# Altium schematic sheet ZLS-018 Rev 5.SchDoc
size OrCAD C
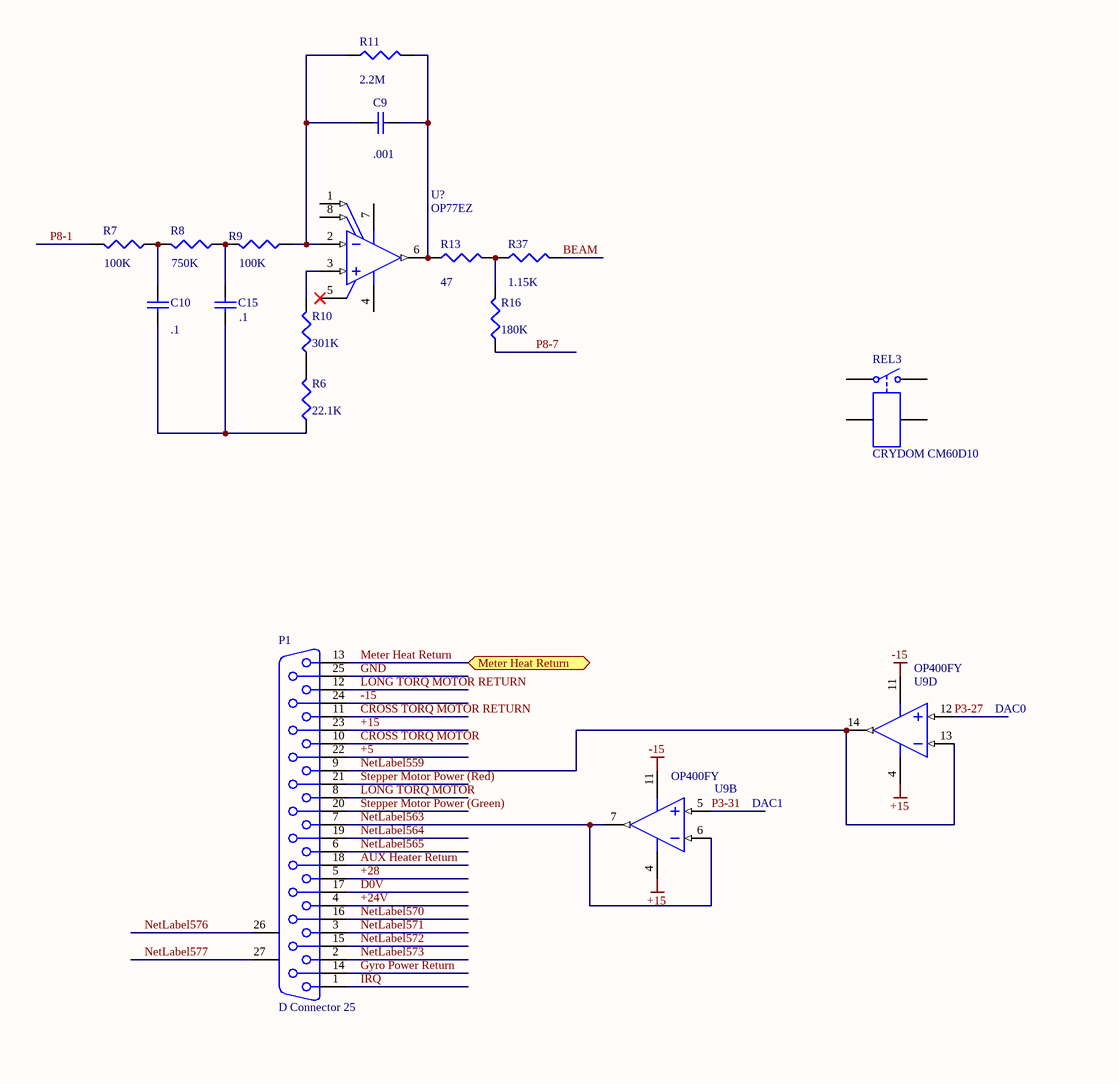
[diagram p0: ZLS-018 Rev 5.SchDoc, top left]
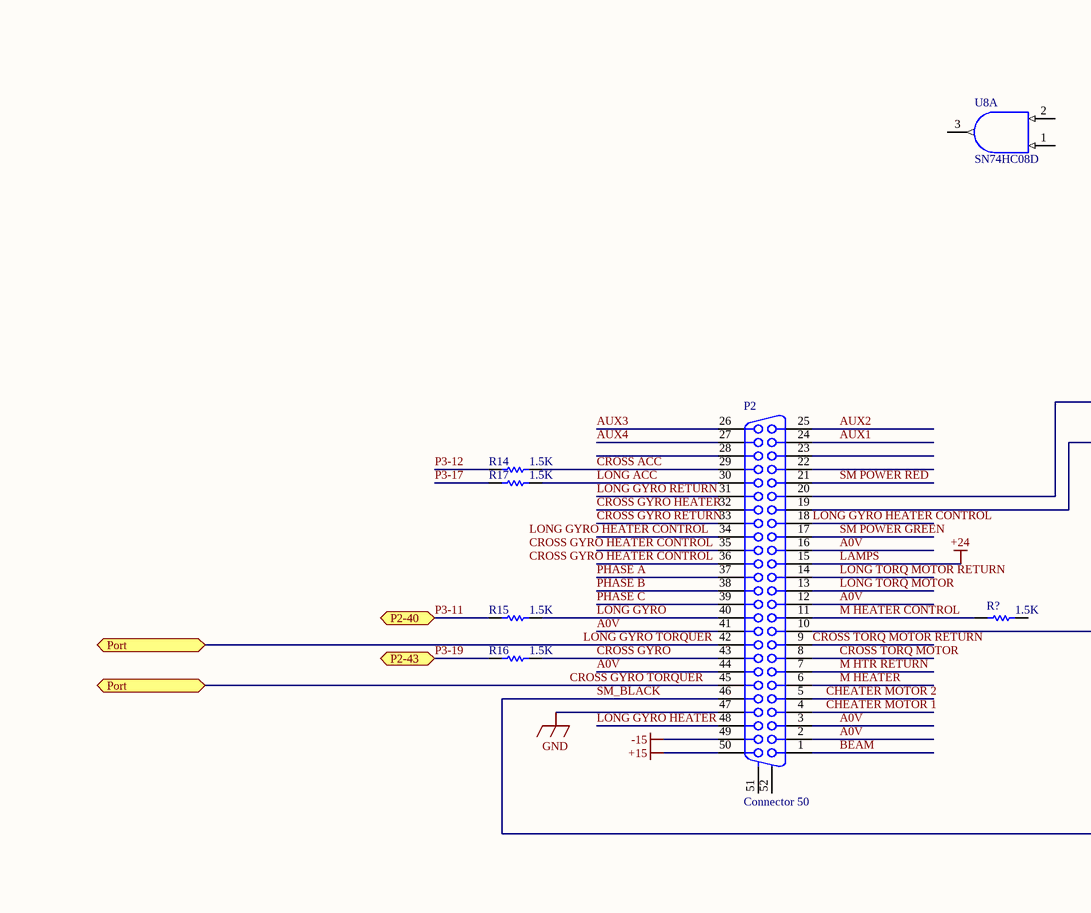
[diagram p1: ZLS-018 Rev 5.SchDoc, bottom left]
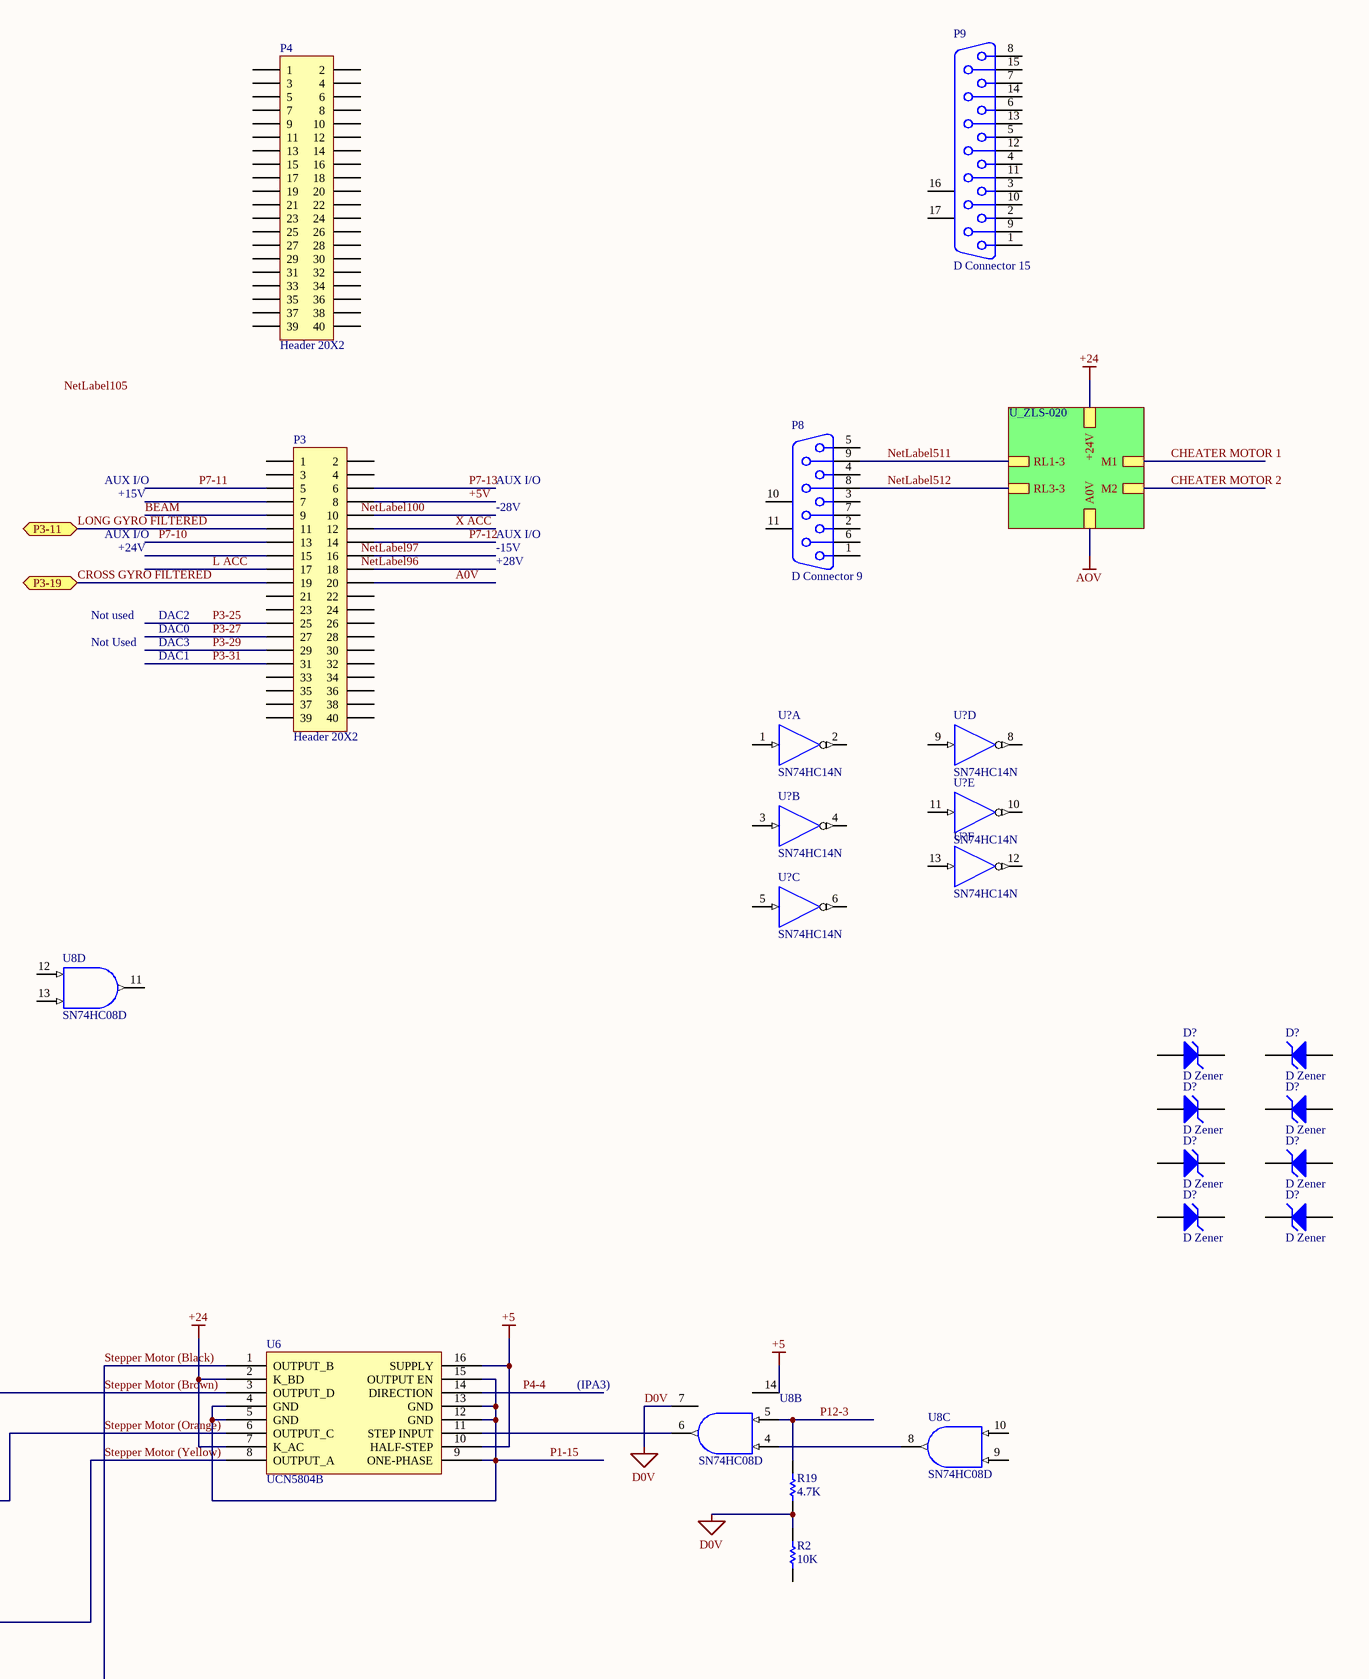
[diagram p2: ZLS-018 Rev 5.SchDoc, bottom right]

## Parts
(Parts that share a designator on the sheet are numbered #1, #2 ... from top to bottom, then left to right.)
C9  value .001  [RAD-0.3]  (hidden comment: Cap)
C10  value .1  [RAD-0.3]  (hidden comment: Cap)
C15  value .1  [RAD-0.3]  (hidden comment: Cap)
D?#1  D Zener  [DIODE-0.7]
D?#2  D Zener  [DIODE-0.7]
D?#3  D Zener  [DIODE-0.7]
D?#4  D Zener  [DIODE-0.7]
D?#5  D Zener  [DIODE-0.7]
D?#6  D Zener  [DIODE-0.7]
D?#7  D Zener  [DIODE-0.7]
D?#8  D Zener  [DIODE-0.7]
P1  D Connector 25  [DSUB1.385-2H25A]
P2  Connector 50  [CHAMP1.27-2H50]
P3  Header 20X2  [HDR2X20]
P4  Header 20X2  [HDR2X20]
P8  D Connector 9  [DSUB1.385-2H9]
P9  D Connector 15  [DSUB1.385-2H15]
R2  value 10K  [AXIAL-0.3]  (hidden comment: Res1)
R6  value 22.1K  [J1-0603]  (hidden comment: Res3)
R7  value 100K  [J1-0603]  (hidden comment: Res3)
R8  value 750K  [J1-0603]  (hidden comment: Res3)
R9  value 100K  [J1-0603]  (hidden comment: Res3)
R10  value 301K  [J1-0603]  (hidden comment: Res3)
R11  value 2.2M  [J1-0603]  (hidden comment: Res3)
R13  value 47  [J1-0603]  (hidden comment: Res3)
R14  value 1.5K  [AXIAL-0.3]  (hidden comment: Res1)
R15  value 1.5K  [AXIAL-0.3]  (hidden comment: Res1)
R16#1  value 180K  [J1-0603]  (hidden comment: Res3)
R16#2  value 1.5K  [AXIAL-0.3]  (hidden comment: Res1)
R17  value 1.5K  [AXIAL-0.3]  (hidden comment: Res1)
R19  value 4.7K  [AXIAL-0.3]  (hidden comment: Res1)
R37  value 1.15K  [J1-0603]  (hidden comment: Res3)
R?  value 1.5K  [AXIAL-0.3]  (hidden comment: Res1)
REL3  CRYDOM CM60D10  [MODULE4]
U6  UCN5804B
U8  SN74HC08D  [D014_N]  (parts A,B,C,D of 4)
U9  OP400FY  [ADI-Q-14]  (parts B,D of 4)
U?#1  OP77EZ  [ADI-Q-8]
U?#2  SN74HC14N  [N014]  (part A of 6)
U?#3  SN74HC14N  [N014]  (part D of 6)
U?#4  SN74HC14N  [N014]  (part E of 6)
U?#5  SN74HC14N  [N014]  (part B of 6)
U?#6  SN74HC14N  [N014]  (part F of 6)
U?#7  SN74HC14N  [N014]  (part C of 6)

## Sub-sheets
U_ZLS-020 = ZLS-020.SchDoc: +24V, RL1-3, RL3-3, A0V, M2, M1

## Ports
Meter Heat Return, P2-40, P2-43, P3-11, P3-19, Port

## Nets
+5: P1.22 U6.10(HALF-STEP) U6.16(SUPPLY) U8.14(VCC) U?#2.14(VCC) U?#3.14(VCC) U?#4.14(VCC) U?#5.14(VCC) U?#6.14(VCC) U?#7.14(VCC)  [also labelled VCC]
+15: P1.23 P2.50 U9.4(+V)
-15: P1.24 P2.49 U9.11(-V)
AOV: sheet U_ZLS-020/A0V
D0V: P1.17 P1.25 P2.47 R2.2 R19.1 U8.7(GND) U?#2.7(GND) U?#3.7(GND) U?#4.7(GND) U?#5.7(GND) U?#6.7(GND) U?#7.7(GND)  [also labelled GND]
LAMPS: P2.15 U6.2(K_BD) U6.7(K_AC) ; sheet U_ZLS-020/+24V  [also labelled +24]
+5V: P3.8
+24V: P1.4
+28: P1.5
A0V: P2.2 P2.3 P2.12 P2.16 P2.41 P2.44 P3.20
AUX1: P2.24
AUX2: P2.25
AUX3: P2.26
AUX4: P2.27
AUX Heater Return: P1.18
BEAM: P2.1 P3.9 R37.2
CHEATER MOTOR 1: P2.4 ; sheet U_ZLS-020/M1
CHEATER MOTOR 2: P2.5 ; sheet U_ZLS-020/M2
CROSS ACC: P2.29 R14.2
CROSS GYRO: P2.43 R16#2.2
CROSS GYRO FILTERED: P3.19 ; port P3-19
CROSS GYRO HEATER: P2.32
CROSS GYRO RETURN: P2.33
CROSS GYRO TORQUER: P2.42 P2.45 ; port Port  [also labelled LONG GYRO TORQUER]
CROSS TORQ MOTOR: P1.10 P2.8
CROSS TORQ MOTOR RETURN: P1.11 P2.9
Gyro Power Return: P1.14
IRQ: P1.1
L ACC: P3.17
LONG ACC: P2.30 R17.2
LONG GYRO: P2.40 R15.2
LONG GYRO FILTERED: P3.11 ; port P3-11
LONG GYRO HEATER: P2.48
LONG GYRO HEATER CONTROL: P2.18
LONG GYRO RETURN: P2.31
LONG TORQ MOTOR: P1.8 P2.13
LONG TORQ MOTOR RETURN: P1.12 P2.14
M HEATER: P2.6
M HEATER CONTROL: P2.11 R?.1
M HTR RETURN: P2.7
Meter Heat Return: P1.13 ; port Meter Heat Return
NetLabel511: P8.9 ; sheet U_ZLS-020/RL1-3
NetLabel512: P8.8 ; sheet U_ZLS-020/RL3-3
NetLabel559: P1.9 U9.13(-IN_D) U9.14(OUT_D)
NetLabel563: P1.7 U9.6(-IN_B) U9.7(OUT_B)
NetLabel564: P1.19
NetLabel565: P1.6
NetLabel570: P1.16
NetLabel571: P1.3
NetLabel572: P1.15
NetLabel573: P1.2
NetLabel576: P1.26(MH1)
NetLabel577: P1.27(MH2)
P1-15: U6.4(GND) U6.5(GND) U6.9(ONE-PHASE) U6.12(GND) U6.13(GND) U6.15(OUTPUT_EN)
P3-11: R15.1 ; port P2-40
P3-12: R14.1
P3-17: R17.1
P3-19: R16#2.1 ; port P2-43
P3-25: P3.25
P3-27: P3.27 U9.12(+IN_D)
P3-29: P3.29
P3-31: P3.31 U9.5(+IN_B)
P4-4: U6.14(DIRECTION)
P7-10: P3.13
P7-11: P3.5
P7-12: P3.14
P7-13: P3.6
P8-1: R7.2
P8-7: R16#1.1
P12-3: R19.2 U8.5(B)
PHASE A: P2.37
PHASE B: P2.38
PHASE C: P2.39
SM POWER GREEN: P2.17
SM POWER RED: P2.21
SM_BLACK: P2.10 P2.19 P2.20 P2.46 U6.1(OUTPUT_B) U6.3(OUTPUT_D) U6.6(OUTPUT_C) U6.8(OUTPUT_A)  [also labelled Stepper Motor (Black), Stepper Motor (Brown), Stepper Motor (Orange), Stepper Motor (Yellow)]
Stepper Motor Power (Green): P1.20
Stepper Motor Power (Red): P1.21
X ACC: P3.12
NetC9_1: C9.1 R9.1 R11.1 U?#1.2(-IN)
NetC9_2: C9.2 R11.2 R13.1 U?#1.6(OUT)
NetC10_1: C10.1 C15.1 R6.1
NetC10_2: C10.2 R7.1 R8.2
NetC15_2: C15.2 R8.1 R9.2
NetR6_2: R6.2 R10.1
NetR10_2: R10.2 U?#1.3(+IN)
NetR13_2: R13.2 R16#1.2 R37.1
NetU6_11: U6.11(STEP_INPUT) U8.6(Y)
NetU8_4: U8.4(A) U8.8(Y)

Not connected (* = marked no-connect by the designer): D?#1 1(A) 2(K); D?#2 1(A) 2(K); D?#3 1(A) 2(K); D?#4 1(A) 2(K); D?#5 1(A) 2(K); D?#6 1(A) 2(K); D?#7 1(A) 2(K); D?#8 1(A) 2(K); P2 22 23 28 34 35 36 51(MH1) 52(MH2); P3 1 2 3 4 7 10 15 16 18 21 22 23 24 26 28 30 32 33 34 35 36 37 38 39 40; P4 1 2 3 4 5 6 7 8 9 10 11 12 13 14 15 16 17 18 19 20 21 22 23 24 25 26 27 28 29 30 31 32 33 34 35 36 37 38 39 40; P8 1 2 3 4 5 6 7 10(MH1) 11(MH2); P9 1 2 3 4 5 6 7 8 9 10 11 12 13 14 15 16(MH1) 17(MH2); R2 1; R? 2; REL3 1 2 3 4; U8 1(A) 2(B) 3(Y) 9(A) 10(B) 11(Y) 12(A) 13(B); U?#1 1(VOS_TRIM) 4(V-) 5(NC)* 7(V+) 8(VOS_TRIM); U?#2 1(A) 2(Y); U?#3 8(Y) 9(A); U?#4 10(Y) 11(A); U?#5 3(A) 4(Y); U?#6 12(Y) 13(A); U?#7 5(A) 6(Y)

## Notes on the sheet
- AUX I/O
- +15V
- -28V
- DAC0
- +24V
- +28V
- -15V
- DAC1
- Not used
- Not Used
- DAC3
- DAC2
- (IPA3)
- Labels drawn without touching a wire or pin: CROSS GYRO HEATER CONTROL, LONG GYRO HEATER CONTROL, NetLabel96, NetLabel97, NetLabel100, NetLabel105
- Title
- Size:
- Date:
- File:
- Orcad C
- Number:
- Time:
- Revision:
- Sheet
- of

## Library data of the parts
C9 C10 C15 = Cap: Capacitor; Published: 8-Jun-2000; LatestRevisionDate: 17-Jul-2002; LatestRevisionNote: Re-released for DXP Platform.; PackageReference: RAD-0.3; Publisher: Altium Limited; PackageDescription: Radial Cap, Thru-Hole; 2 Leads; 0.3 in Pin Spacing
D?#1-D?#8 = D Zener: Zener Diode; Published: 8-Jun-2000; LatestRevisionDate: 17-Jul-2002; LatestRevisionNote: Re-released for DXP Platform.; PackageReference: DIODE-0.7; Publisher: Altium Limited; PackageDescription: Diode, Thru-Hole; 2 Leads; 0.7 in Pin Spacing
P1 = D Connector 25: Receptacle Assembly, 25 Position, Right Angle; PackageDocument: U; Positions: 25; Published: 15-Jun-2001; LatestRevisionDate: 17-Jul-2002; LatestRevisionNote: Re-released for DXP Platform.; DatasheetDocument: 19-Mar-1999; PackageReference: 787202; Publisher: Altium Limited; Orientation: Right Angle; Gender: Receptacle
P2 = Connector 50: Receptacle Header Assemby; PackageDocument: B; Positions: 50; Published: 15-Jun-2001; LatestRevisionDate: 17-Jul-2002; LatestRevisionNote: Re-released for DXP Platform.; DatasheetDocument: 1-Oct-1983; PackageReference: 178240-7; Publisher: Altium Limited; Orientation: Right Angle
P3 P4 = Header 20X2: Header, 20-Pin, Dual row; LatestRevisionDate: 17-Jul-2002; LatestRevisionNote: Re-released for DXP Platform.; Publisher: Altium Limited
P8 = D Connector 9: Receptacle Assembly, 9 Position, Right Angle; PackageDocument: O; Positions: 9; Published: 15-Jun-2001; LatestRevisionDate: 17-Jul-2002; LatestRevisionNote: Re-released for DXP Platform.; DatasheetDocument: 1-Sep-1999; PackageReference: 788750; Publisher: Altium Limited; Orientation: Right Angle; Gender: Receptacle
P9 = D Connector 15: Receptacle Assembly, 15 Position, Right Angle; PackageDocument: O; Positions: 15; Published: 15-Jun-2001; LatestRevisionDate: 17-Jul-2002; LatestRevisionNote: Re-released for DXP Platform.; DatasheetDocument: 1-Sep-99; PackageReference: 788757; Publisher: Altium Limited; Orientation: Right Angle; Gender: Receptacle
R2 R14 R15 R16#2 R17 R19 R? = Res1: Resistor; Published: 8-Jun-2000; LatestRevisionDate: 17-Jul-2002; LatestRevisionNote: Re-released for DXP Platform.; PackageReference: AXIAL-0.3; Publisher: Altium Limited; PackageDescription: Axial Device, Thru-Hole; 2 Leads; 0.3 in Pin Spacing
R6-R11 R13 R16#1 R37 = Res3: Resistor; Published: 8-Jun-2000; LatestRevisionDate: 29-May-2009; LatestRevisionNote: IPC-7351 Footprint Added.; PackageReference: J1-0603; Publisher: Altium Limited; PackageDescription: Chip Resistor
REL3 = Relay-SPST: Single-Pole Single-Throw Relay; Published: 24-Mar-1999; LatestRevisionDate: 17-Jul-2002; LatestRevisionNote: Re-released for DXP Platform.; PackageReference: MODULE4; Publisher: Altium Limited
U8 = SN74HC08D: Quadruple 2-Input Positive-AND Gate; Published: 8-Jun-2000; LatestRevisionDate: 13-Apr-2006; LatestRevisionNote: IPC-7351 Footprint Added.; DatasheetVersion: May-1997; PackageVersion: Jan-1998; PackageReference: D014; Publisher: Altium Limited; PackageDescription: 14-Pin Small Outline Integrated Circuit 1.27 mm Pitch; Code_IPC: SOIC127P600-14; ComponentLink1Description: Manufacturer Link; ComponentLink1URL: http://www.ti.com/; ComponentLink2Description: Datasheet; ComponentLink2URL: http://www-s.ti.com/sc/ds/SN74HC08.pdf
U9 = CMP-0384-00277-1: Quad Channel Low Supply Current Operational Amplifier, 500 KHz BW, 150 mV/us SR, Industrial, 14-pin DIP (Q-14), Tube; Manufacturer: Analog Devices; Generic Part Number: OP400; Small Signal Bandwidth: 500KHz; Input Bias Current: 750pA; Input Offset Voltage: 80uV; Iq/Amp: 725uA; V Span Max: 40V; Amplifiers Per Package: 4; V Span Min: 6V; Packing: Tube; Mounting Technology: Through Hole; ComponentLink3Description: Package Specification; Slew Rate: 150mV/us; ComponentLink2Description: Datasheet; ComponentLink1Description: Manufacturer URL; ComponentLink1URL: http://www.analog.com/en/index.html; PackageDescription: 14-Pin Ceramic Dual In-Line Package, Row spacing 7.62 mm, Pitch 2.54 mm; ComponentLink2URL: http://www.analog.com/static/imported-files/data_sheets/OP400.pdf; DatasheetVersion: Rev. G; PackageReference: Q-14; PartNumber: OP400FY; ComponentLink3URL: http://www.analog.com/static/imported-files/packages/393665681442905251546090Q_14.pdf
U?#1 = CMP-0384-00323-1: Single Channel Ultra High Gain Operational Amplifier, 600 KHz BW, 300 mV/us SR, Industrial, 8-pin DIP (Q-8), Tube; Generic Part Number: OP77; Manufacturer: Analog Devices; Iq/Amp: 2mA; Small Signal Bandwidth: 600KHz; V Span Max: 44V; Input Bias Current: 1.2nA; Amplifiers Per Package: 1; Input Offset Voltage: 10uV; V Span Min: 6V; ComponentLink2Description: Datasheet; ComponentLink3URL: http://www.analog.com/static/imported-files/packages/3925655241313314758Q_8.pdf; PartNumber: OP77EZ; ComponentLink2URL: http://www.analog.com/static/imported-files/data_sheets/OP77.pdf; PackageDescription: 8-Pin Ceramic Dual In-Line Package, Row spacing 7.62 mm, Pitch 2.54 mm; PackageReference: Q-8; ComponentLink1Description: Manufacturer URL; Mounting Technology: Through Hole; ComponentLink3Description: Package Specification; ComponentLink1URL: http://www.analog.com/en/index.html; Slew Rate: 300mV/us; DatasheetVersion: Rev. E; Packing: Tube
U?#2-U?#7 = SN74HC14N: Hex Schmitt-Trigger Inverter; Published: 8-Jun-2000; LatestRevisionDate: 04-Mar-2005; LatestRevisionNote: Stylized 3D Model Added.; DatasheetVersion: May-1997; PackageVersion: Oct-1995; PackageReference: N014; Publisher: Altium Limited; PackageDescription: DIP; 14 Leads; Row Spacing 7.62 mm; Pitch 2.54 mm; ComponentLink1Description: Manufacturer Link; ComponentLink1URL: http://www.ti.com/; ComponentLink2Description: Datasheet; ComponentLink2URL: http://www-s.ti.com/sc/ds/sn74hc14.pdf